# EAGLE design addressing-auto (EAGLE 7.7.0)
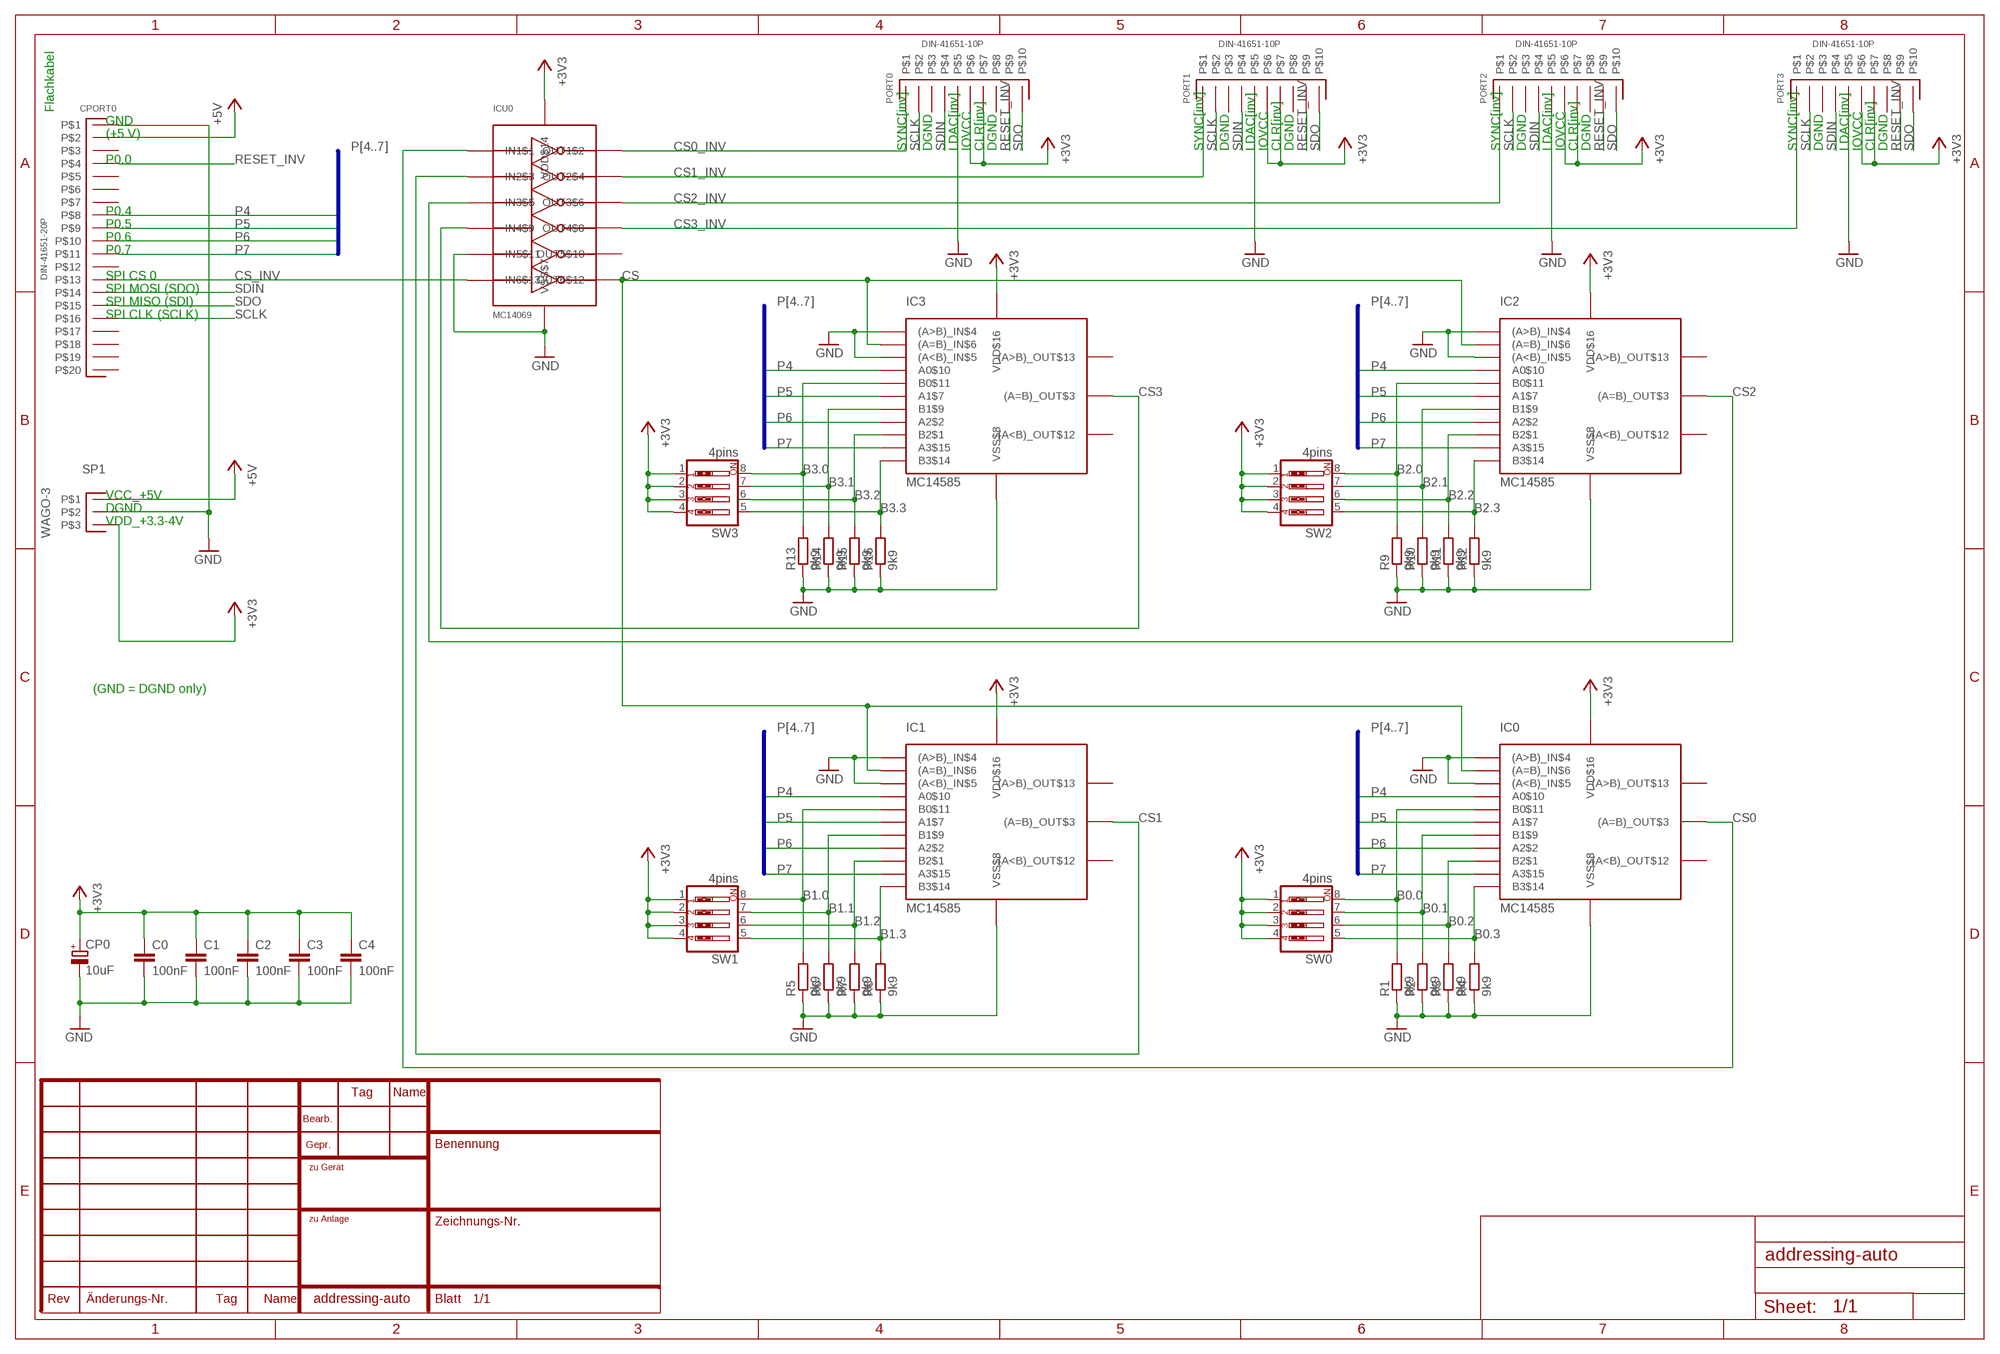
[diagram p0: schematic, sheet 1]

## Parts
C0  100nF  C-EU075-032X103  [C075-032X103]
C1  100nF  C-EU075-032X103  [C075-032X103]
C2  100nF  C-EU075-032X103  [C075-032X103]
C3  100nF  C-EU075-032X103  [C075-032X103]
C4  100nF  C-EU075-032X103  [C075-032X103]
CP0  10uF  CPOL-EUB45181B  [B45181B]
CPORT0  DIN-41651-20P  [DIN-41651-20P]
IC0  MC14585  [PDIP-16]
IC1  MC14585  [PDIP-16]
IC2  MC14585  [PDIP-16]
IC3  MC14585  [PDIP-16]
ICU0  MC14069  [PDIP-14]
PORT0  DIN-41651-10P  [DIN-41651-10P]
PORT1  DIN-41651-10P  [DIN-41651-10P]
PORT2  DIN-41651-10P  [DIN-41651-10P]
PORT3  DIN-41651-10P  [DIN-41651-10P]
R1  9k9  R-EU_0207/12  [0207/12]
R2  9k9  R-EU_0207/12  [0207/12]
R3  9k9  R-EU_0207/12  [0207/12]
R4  9k9  R-EU_0207/12  [0207/12]
R5  9k9  R-EU_0207/12  [0207/12]
R6  9k9  R-EU_0207/12  [0207/12]
R7  9k9  R-EU_0207/12  [0207/12]
R8  9k9  R-EU_0207/12  [0207/12]
R9  9k9  R-EU_0207/12  [0207/12]
R10  9k9  R-EU_0207/12  [0207/12]
R11  9k9  R-EU_0207/12  [0207/12]
R12  9k9  R-EU_0207/12  [0207/12]
R13  9k9  R-EU_0207/12  [0207/12]
R14  9k9  R-EU_0207/12  [0207/12]
R15  9k9  R-EU_0207/12  [0207/12]
R16  9k9  R-EU_0207/12  [0207/12]
SP1  WAGO-3  [WAGO-3]
SW0  4pins  SW_DIP-4  [EDG-04]
SW1  4pins  SW_DIP-4  [EDG-04]
SW2  4pins  SW_DIP-4  [EDG-04]
SW3  4pins  SW_DIP-4  [EDG-04]

## Nets
+3V3: C0.1 C1.1 C2.1 C3.1 C4.1 CP0.+ IC0.VDD$16 IC1.VDD$16 IC2.VDD$16 IC3.VDD$16 ICU0.VDD$14 PORT0.P$6 PORT0.P$7 PORT1.P$6 PORT1.P$7 PORT2.P$6 PORT2.P$7 PORT3.P$6 PORT3.P$7 SP1.P$3 SW0.1 SW0.2 SW0.3 SW0.4 SW1.1 SW1.2 SW1.3 SW1.4 SW2.1 SW2.2 SW2.3 SW2.4 SW3.1 SW3.2 SW3.3 SW3.4
+5V: CPORT0.P$2 SP1.P$1
B0.0: IC0.B0$11 R1.2 SW0.8
B0.1: IC0.B1$9 R2.2 SW0.7
B0.2: IC0.B2$1 R3.2 SW0.6
B0.3: IC0.B3$14 R4.2 SW0.5
B1.0: IC1.B0$11 R5.2 SW1.8
B1.1: IC1.B1$9 R6.2 SW1.7
B1.2: IC1.B2$1 R7.2 SW1.6
B1.3: IC1.B3$14 R8.2 SW1.5
B2.0: IC2.B0$11 R9.2 SW2.8
B2.1: IC2.B1$9 R10.2 SW2.7
B2.2: IC2.B2$1 R11.2 SW2.6
B2.3: IC2.B3$14 R12.2 SW2.5
B3.0: IC3.B0$11 R13.2 SW3.8
B3.1: IC3.B1$9 R14.2 SW3.7
B3.2: IC3.B2$1 R15.2 SW3.6
B3.3: IC3.B3$14 R16.2 SW3.5
CS: IC0.(A=B)_IN$6 IC1.(A=B)_IN$6 IC2.(A=B)_IN$6 IC3.(A=B)_IN$6 ICU0.OUT6$12
CS0: IC0.(A=B)_OUT$3 ICU0.IN1$1
CS0_INV: ICU0.OUT1$2 PORT0.P$1
CS1: IC1.(A=B)_OUT$3 ICU0.IN2$3
CS1_INV: ICU0.OUT2$4 PORT1.P$1
CS2: IC2.(A=B)_OUT$3 ICU0.IN3$5
CS2_INV: ICU0.OUT3$6 PORT2.P$1
CS3: IC3.(A=B)_OUT$3 ICU0.IN4$9
CS3_INV: ICU0.OUT4$8 PORT3.P$1
CS_INV: CPORT0.P$13 ICU0.IN6$13
GND: C0.2 C1.2 C2.2 C3.2 C4.2 CP0.- CPORT0.P$1 IC0.(A<B)_IN$5 IC0.(A>B)_IN$4 IC0.VSS$8 IC1.(A<B)_IN$5 IC1.(A>B)_IN$4 IC1.VSS$8 IC2.(A<B)_IN$5 IC2.(A>B)_IN$4 IC2.VSS$8 IC3.(A<B)_IN$5 IC3.(A>B)_IN$4 IC3.VSS$8 ICU0.IN5$11 ICU0.VSS$7 PORT0.P$5 PORT1.P$5 PORT2.P$5 PORT3.P$5 R1.1 R2.1 R3.1 R4.1 R5.1 R6.1 R7.1 R8.1 R9.1 R10.1 R11.1 R12.1 R13.1 R14.1 R15.1 R16.1 SP1.P$2
P4: CPORT0.P$8 IC0.A0$10 IC1.A0$10 IC2.A0$10 IC3.A0$10
P5: CPORT0.P$9 IC0.A1$7 IC1.A1$7 IC2.A1$7 IC3.A1$7
P6: CPORT0.P$10 IC0.A2$2 IC1.A2$2 IC2.A2$2 IC3.A2$2
P7: CPORT0.P$11 IC0.A3$15 IC1.A3$15 IC2.A3$15 IC3.A3$15
RESET_INV: CPORT0.P$4 PORT0.P$9 PORT1.P$9 PORT2.P$9 PORT3.P$9
SCLK: CPORT0.P$16 PORT0.P$2 PORT1.P$2 PORT2.P$2 PORT3.P$2
SDIN: CPORT0.P$14 PORT0.P$4 PORT1.P$4 PORT2.P$4 PORT3.P$4
SDO: CPORT0.P$15 PORT0.P$10 PORT1.P$10 PORT2.P$10 PORT3.P$10
Unconnected: CPORT0.P$3 CPORT0.P$5 CPORT0.P$6 CPORT0.P$7 CPORT0.P$12 CPORT0.P$17 CPORT0.P$18 CPORT0.P$19 CPORT0.P$20 IC0.(A<B)_OUT$12 IC0.(A>B)_OUT$13 IC1.(A<B)_OUT$12 IC1.(A>B)_OUT$13 IC2.(A<B)_OUT$12 IC2.(A>B)_OUT$13 IC3.(A<B)_OUT$12 IC3.(A>B)_OUT$13 ICU0.OUT5$10 PORT0.P$3 PORT0.P$8 PORT1.P$3 PORT1.P$8 PORT2.P$3 PORT2.P$8 PORT3.P$3 PORT3.P$8

## Buses
P[4..7]

## Notes on the sheet
- Flachkabel
- GND
- (+5 V)
- SYNC[inv] | DGND | LDAC[inv] | IOVCC | CLR[inv] | DGND | SYNC[inv] | DGND | LDAC[inv] | IOVCC | CLR[inv] | DGND | SYNC[inv] | DGND | LDAC[inv] | IOVCC | CLR[inv] | DGND | SYNC[inv] | DGND | LDAC[inv] | IOVCC | CLR[inv] | DGND
- P0.0
- P0.4
- P0.5
- P0.6
- P0.7
- SPI CS 0
- SPI MOSI (SDO)
- SPI MISO (SDI)
- SPI CLK (SCLK)
- VCC_+5V
- DGND
- VDD_+3.3-4V
- (GND = DGND only)

## Library data of the parts
C0 C1-C4 = rcl:C-EU: CAPACITOR, European symbol
CP0 = rcl:CPOL-EU: POLARIZED CAPACITOR, European symbol
CPORT0 = parts:DIN-41651-20P
IC0 IC1-IC3 = parts:MC14585
ICU0 = parts:MC14069
PORT0 PORT1-PORT3 = parts:DIN-41651-10P
R1-R16 = rcl:R-EU_: RESISTOR, European symbol
SP1 = parts:WAGO-3
SW0 SW1-SW3 = special:SW_DIP-4: DIP SWITCH

## Board
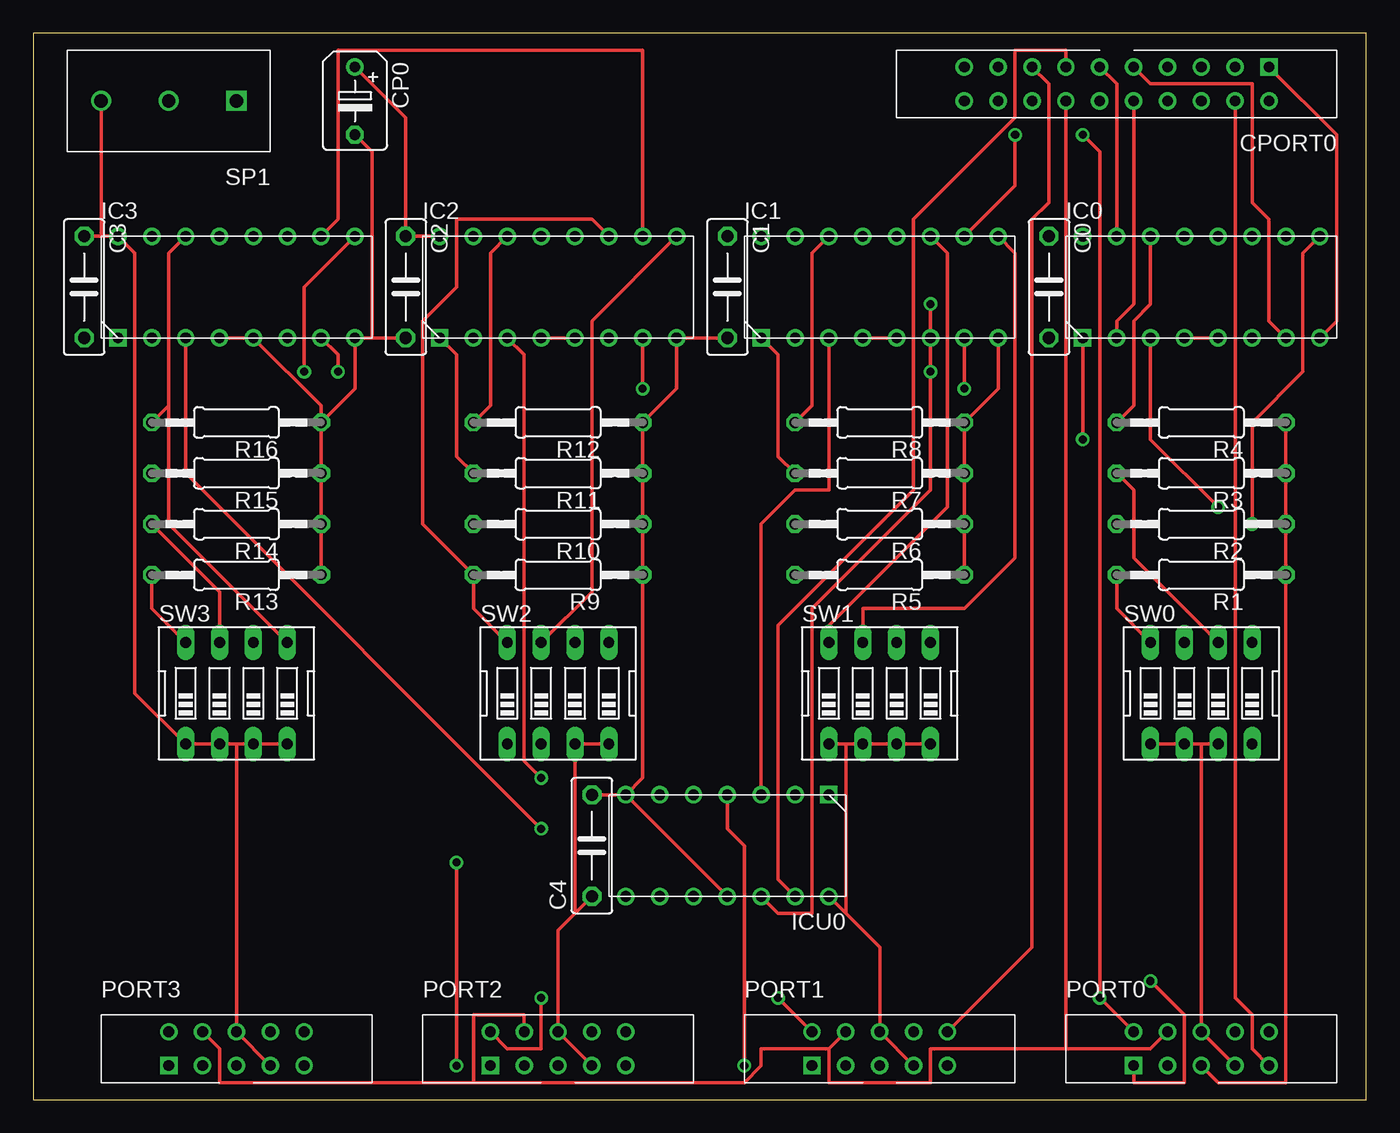
[diagram p1: board, top side]
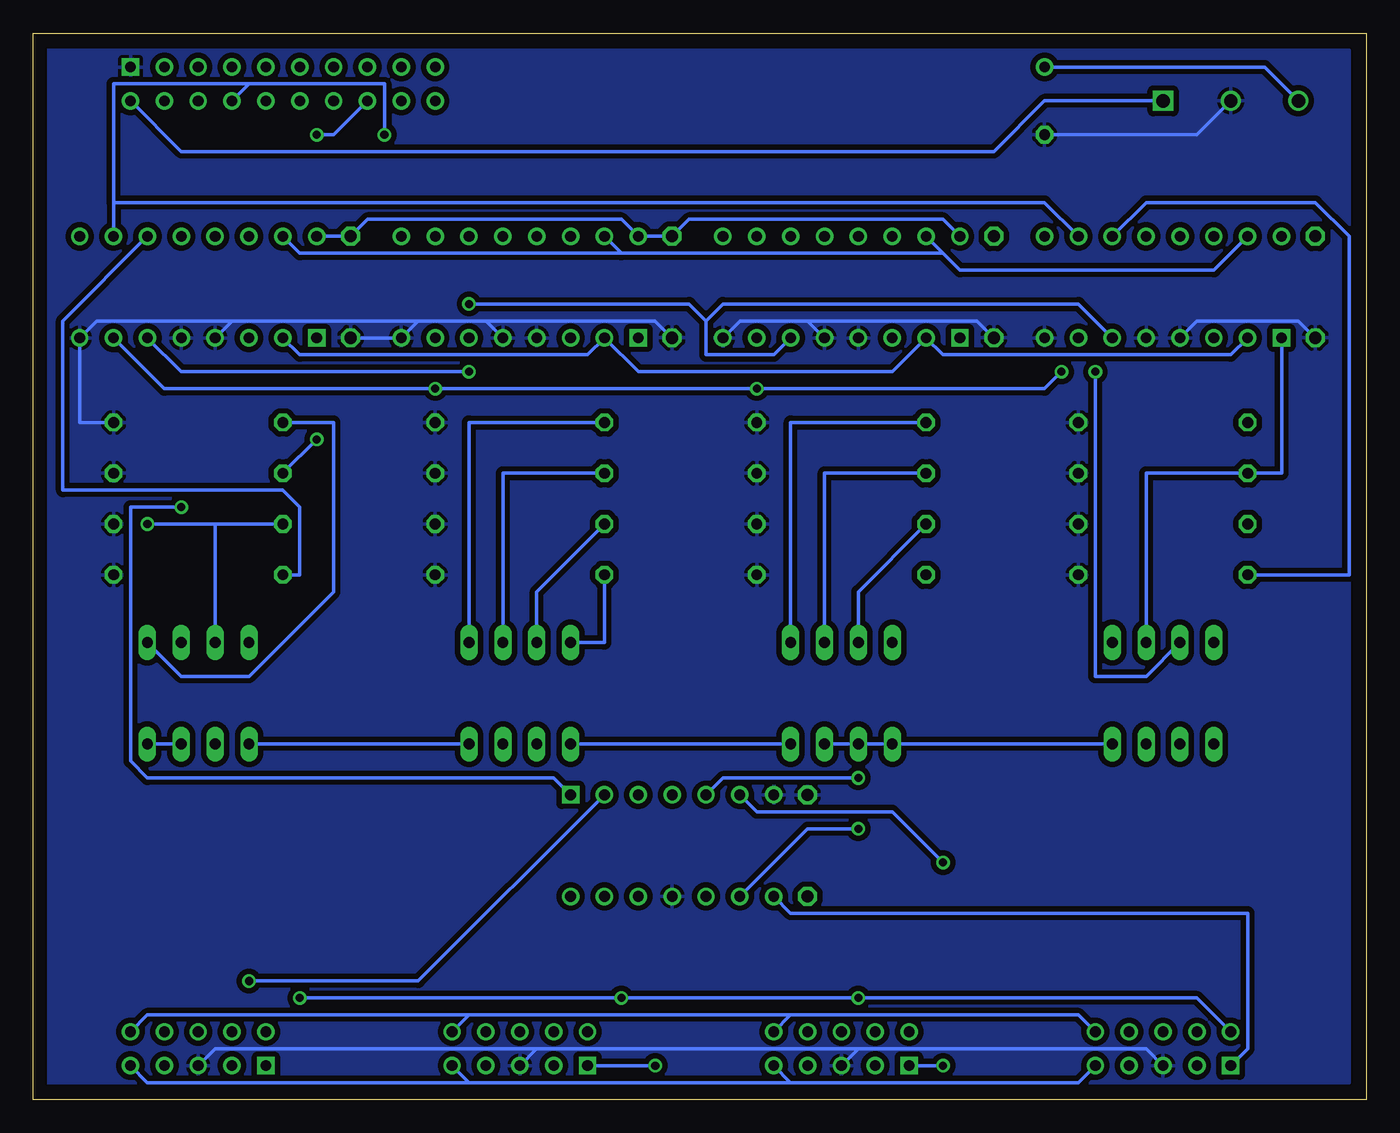
[diagram p2: board, bottom side, seen from below]

Size 100 x 80 mm. Coordinates in mm from the lower left corner, seen from the top.
Outline: 0,0 100,0 100,80 0,80 0,0
Copper layers (1*16): Top 0.035mm / dielectric 1.5mm / Bottom 0.035mm
Design rules "default": minimum track width 10mil, minimum drill 24mil, track to track 8mil, track to pad 8mil, pad to pad 8mil, via to via 8mil, smd to smd 8mil, copper to edge 40mil, drill to drill 8mil, minimum pad ring 10mil, minimum via ring 8mil, stop-mask expansion 4mil, vias tented up to drill 0mil, thermal gap 10mil

### Footprints (pad centres in the part's own frame; a part is rotated, then mirrored left to right if it is on the bottom)
C075-032X103 = drill 0.914 octagon: 1 -3.81,0; 2 3.81,0
B45181B = drill 0.813: + -2.54,0 | drill 0.813 octagon: - 2.54,0
DIN-41651-20P = drill 0.8 square: P$1 -11.43,-1.27 | drill 0.8: P$2 -11.43,1.27; P$3 -8.89,-1.27; P$4 -8.89,1.27; P$5 -6.35,-1.27; P$6 -6.35,1.27; P$7 -3.81,-1.27; P$8 -3.81,1.27; P$9 -1.27,-1.27; P$10 -1.27,1.27; P$11 1.27,-1.27; P$12 1.27,1.27; P$13 3.81,-1.27; P$14 3.81,1.27; P$15 6.35,-1.27; P$16 6.35,1.27; P$17 8.89,-1.27; P$18 8.89,1.27; P$19 11.43,-1.27; P$20 11.43,1.27
PDIP-16 = drill 0.8: (A<B)_IN$5 1.27,-3.81; (A<B)_OUT$12 1.27,3.81; (A=B)_IN$6 3.81,-3.81; (A=B)_OUT$3 -3.81,-3.81; (A>B)_IN$4 -1.27,-3.81; (A>B)_OUT$13 -1.27,3.81; A0$10 6.35,3.81; A1$7 6.35,-3.81; A2$2 -6.35,-3.81; A3$15 -6.35,3.81; B0$11 3.81,3.81; B1$9 8.89,3.81; B3$14 -3.81,3.81; VDD$16 -8.89,3.81; VSS$8 8.89,-3.81 | drill 0.8 square: B2$1 -8.89,-3.81
PDIP-14 = drill 0.8 square: IN1$1 -7.62,-3.81 | drill 0.8: IN2$3 -2.54,-3.81; IN3$5 2.54,-3.81; IN4$9 5.08,3.81; IN5$11 0,3.81; IN6$13 -5.08,3.81; OUT1$2 -5.08,-3.81; OUT2$4 0,-3.81; OUT3$6 5.08,-3.81; OUT4$8 7.62,3.81; OUT5$10 2.54,3.81; OUT6$12 -2.54,3.81; VDD$14 -7.62,3.81; VSS$7 7.62,-3.81
DIN-41651-10P = drill 0.8 square: P$1 -5.08,-1.27 | drill 0.8: P$2 -5.08,1.27; P$3 -2.54,-1.27; P$4 -2.54,1.27; P$5 0,-1.27; P$6 0,1.27; P$7 2.54,-1.27; P$8 2.54,1.27; P$9 5.08,-1.27; P$10 5.08,1.27
0207/12 = drill 0.813 octagon: 1 -6.35,0; 2 6.35,0
WAGO-3 = drill 1 square: P$1 -5.08,0 | drill 1: P$2 0,0; P$3 5.08,0
EDG-04 = drill 0.813 long: 1 -3.81,-3.81; 2 -1.27,-3.81; 3 1.27,-3.81; 4 3.81,-3.81; 5 3.81,3.81; 6 1.27,3.81; 7 -1.27,3.81; 8 -3.81,3.81

### Placement (x,y rotation side)
C0  76.2,60.96 270 top
C1  52.07,60.96 270 top
C2  27.94,60.96 270 top
C3  3.81,60.96 270 top
C4  41.91,19.05 90 top
CP0  24.13,74.93 270 top
CPORT0  81.28,76.2 180 top
IC0  87.63,60.96 0 top
IC1  63.5,60.96 0 top
IC2  39.37,60.96 0 top
IC3  15.24,60.96 0 top
ICU0  52.07,19.05 180 top
PORT0  87.63,3.81 0 top
PORT1  63.5,3.81 0 top
PORT2  39.37,3.81 0 top
PORT3  15.24,3.81 0 top
R1  87.63,39.37 180 top
R2  87.63,43.18 180 top
R3  87.63,46.99 180 top
R4  87.63,50.8 180 top
R5  63.5,39.37 180 top
R6  63.5,43.18 180 top
R7  63.5,46.99 180 top
R8  63.5,50.8 180 top
R9  39.37,39.37 180 top
R10  39.37,43.18 180 top
R11  39.37,46.99 180 top
R12  39.37,50.8 180 top
R13  15.24,39.37 180 top
R14  15.24,43.18 180 top
R15  15.24,46.99 180 top
R16  15.24,50.8 180 top
SP1  10.16,74.93 180 top
SW0  87.63,30.48 0 top
SW1  63.5,30.48 0 top
SW2  39.37,30.48 0 top
SW3  15.24,30.48 0 top

### Tracks (layer width: path | path; a pad name or v marks a point on that pad's centre or on a via)
+3V3
  Top 0.254: 5.08,64.77 C3.1 | 5.08,64.77 IC3.VDD$16 7.62,63.5 7.62,30.48 SW3.1 SW3.2 15.24,26.67 | 5.08,64.77 SP1.P$3 | IC2.VDD$16 C2.1 27.94,73.66 CP0.+ | PORT3.P$7 PORT3.P$6 15.24,26.67 | 15.24,26.67 SW3.3 SW3.4 | SW2.4 SW2.3 40.64,13.97 | PORT2.P$7 PORT2.P$6 39.37,12.7 40.64,13.97 | 40.64,13.97 C4.1 | 60.96,26.67 SW1.2 SW1.3 SW1.4 | SW1.1 60.96,26.67 | PORT1.P$7 PORT1.P$6 63.5,11.43 60.96,13.97 | 60.96,13.97 ICU0.VDD$14 | 60.96,26.67 60.96,13.97 | PORT0.P$7 PORT0.P$6 87.63,26.67 | SW0.1 SW0.2 87.63,26.67 | 87.63,26.67 SW0.3
  Bottom 0.254: IC0.VDD$16 C0.1 74.93,66.04 55.88,66.04 IC1.VDD$16 C1.1 50.8,66.04 31.75,66.04 IC2.VDD$16 | SP1.P$3 7.62,77.47 CP0.+ | SW2.3 SW2.2 SW2.1 SW3.4 | SW0.3 SW0.4 | SW1.4 SW0.1 | SW2.4 SW1.1
+5V
  Bottom 0.254: CPORT0.P$2 88.9,71.12 27.94,71.12 24.13,74.93 SP1.P$1
B0.0
  Top 0.254: SW0.8 81.28,36.83 R1.2
  Bottom 0.254: IC0.B0$11 97.79,58.42 97.79,45.72 81.28,45.72 80.01,44.45 80.01,39.37 R1.2
B0.1  (via drill 0.61)
  Top 0.254: IC0.B1$9 95.25,63.5 95.25,54.61 91.44,50.8 v91.44,43.18
  Bottom 0.254: 86.36,43.18 R2.2 | 86.36,43.18 v91.44,43.18 | SW0.7 86.36,43.18
B0.2  (via drill 0.61)
  Top 0.254: v78.74,49.53 IC0.B2$1 | SW0.6 82.55,40.64 82.55,45.72 R3.2
  Bottom 0.254: R3.2 v78.74,49.53
B0.3
  Top 0.254: IC0.B3$14 83.82,59.69 82.55,58.42 82.55,52.07 R4.2
  Bottom 0.254: SW0.5 88.9,31.75 83.82,31.75 77.47,38.1 77.47,50.8 R4.2
B1.0
  Top 0.254: IC1.B0$11 68.58,63.5 68.58,44.45 59.69,35.56 SW1.8
  Bottom 0.254: R5.2 57.15,34.29 SW1.8
B1.1
  Top 0.254: IC1.B1$9 73.66,63.5 73.66,40.64 69.85,36.83 62.23,36.83 SW1.7
  Bottom 0.254: R6.2 62.23,38.1 SW1.7
B1.2
  Top 0.254: IC1.B2$1 55.88,55.88 55.88,48.26 R7.2
  Bottom 0.254: SW1.6 64.77,46.99 R7.2
B1.3
  Top 0.254: IC1.B3$14 58.42,63.5 58.42,52.07 R8.2
  Bottom 0.254: SW1.5 67.31,50.8 R8.2
B2.0
  Top 0.254: IC2.B0$11 41.91,66.04 31.75,66.04 31.75,60.96 29.21,58.42 29.21,43.18 R9.2 33.02,36.83 SW2.8
B2.1
  Top 0.254: IC2.B1$9 41.91,58.42 41.91,38.1 SW2.7
  Bottom 0.254: R10.2 38.1,38.1 SW2.7
B2.2
  Top 0.254: IC2.B2$1 31.75,55.88 31.75,48.26 R11.2
  Bottom 0.254: SW2.6 40.64,46.99 R11.2
B2.3
  Top 0.254: IC2.B3$14 34.29,63.5 34.29,52.07 R12.2
  Bottom 0.254: SW2.5 43.18,50.8 R12.2
B3.0
  Top 0.254: SW3.8 8.89,36.83 R13.2
  Bottom 0.254: IC3.B0$11 16.51,67.31 3.81,67.31 1.27,64.77 1.27,39.37 R13.2
B3.1  (via drill 0.61)
  Top 0.254: IC3.B1$9 20.32,60.96 v20.32,54.61 | R14.2 13.97,38.1 SW3.7
  Bottom 0.254: v20.32,54.61 20.32,31.75 16.51,31.75 SW3.7
B3.2
  Bottom 0.254: IC3.B2$1 6.35,46.99 R15.2 16.51,46.99 SW3.6
B3.3
  Top 0.254: IC3.B3$14 10.16,63.5 10.16,52.07 | 10.16,52.07 R16.2 | SW3.5 10.16,43.18 10.16,52.07
CS  (via drill 0.61)
  Top 0.254: ICU0.OUT6$12 55.88,13.97 58.42,13.97 58.42,36.83 67.31,45.72 v67.31,54.61 IC1.(A=B)_IN$6 v67.31,59.69
  Bottom 0.254: IC3.(A=B)_IN$6 21.59,59.69 48.26,59.69 49.53,58.42 | 49.53,58.42 49.53,55.88 44.45,55.88 IC2.(A=B)_IN$6 | IC0.(A=B)_IN$6 88.9,54.61 v67.31,54.61 | 49.53,58.42 50.8,59.69 v67.31,59.69
CS0  (via drill 0.61)
  Top 0.254: v88.9,44.45 83.82,49.53 IC0.(A=B)_OUT$3
  Bottom 0.254: ICU0.IN1$1 60.96,24.13 91.44,24.13 92.71,25.4 92.71,44.45 v88.9,44.45
CS0_INV  (via drill 0.61)
  Top 0.254: v83.82,8.89 86.36,6.35 86.36,1.27 82.55,1.27 PORT0.P$1
  Bottom 0.254: ICU0.OUT1$2 71.12,8.89 v83.82,8.89
CS1
  Top 0.254: ICU0.IN2$3 54.61,43.18 57.15,45.72 59.69,45.72 IC1.(A=B)_OUT$3
CS1_INV  (via drill 0.61)
  Top 0.254: v53.34,2.54 53.34,19.05 52.07,20.32 ICU0.OUT2$4
  Bottom 0.254: v53.34,2.54 PORT1.P$1
CS2  (via drill 0.61)
  Top 0.254: v38.1,24.13 36.83,25.4 36.83,55.88 IC2.(A=B)_OUT$3
  Bottom 0.254: ICU0.IN3$5 48.26,24.13 v38.1,24.13
CS2_INV  (via drill 0.61)
  Top 0.254: v31.75,2.54 v31.75,17.78
  Bottom 0.254: v31.75,2.54 PORT2.P$1 | v31.75,17.78 35.56,21.59 45.72,21.59 ICU0.OUT3$6
CS3  (via drill 0.61)
  Top 0.254: v38.1,20.32 11.43,46.99 IC3.(A=B)_OUT$3
  Bottom 0.254: ICU0.IN4$9 41.91,20.32 v38.1,20.32
CS3_INV
  Bottom 0.254: PORT3.P$1 8.89,3.81 8.89,13.97 43.18,13.97 ICU0.OUT4$8
CS_INV
  Top 0.254: ICU0.IN6$13 55.88,16.51 55.88,35.56 66.04,45.72 66.04,66.04 73.66,73.66 73.66,78.74 77.47,78.74 CPORT0.P$13
GND
  Top 0.254: IC3.(A>B)_IN$4 IC3.(A<B)_IN$5 21.59,52.07 R16.1 | R13.1 R14.1 R15.1 R16.1 | C2.2 25.4,57.15 | 25.4,57.15 IC3.VSS$8 24.13,53.34 R16.1 | CP0.- 25.4,71.12 25.4,57.15 | ICU0.VSS$7 C4.2 | ICU0.VSS$7 ICU0.IN5$11 | IC2.(A<B)_IN$5 IC2.(A>B)_IN$4 | C1.2 IC2.VSS$8 48.26,53.34 R12.1 R11.1 R10.1 R9.1 45.72,24.13 ICU0.VSS$7 | CPORT0.P$1 97.79,72.39 97.79,58.42 IC0.VSS$8 | R4.1 R3.1 R2.1 R1.1 93.98,1.27 88.9,1.27 PORT0.P$5 | R5.1 R6.1 R7.1 R8.1 72.39,53.34 IC1.VSS$8 | IC0.(A>B)_IN$4 IC0.(A<B)_IN$5 | IC1.(A<B)_IN$5 IC1.(A>B)_IN$4
  Bottom 0.254: PORT3.P$5 16.51,3.81 38.1,3.81 | 38.1,3.81 PORT2.P$5 | 62.23,3.81 PORT1.P$5 | 38.1,3.81 62.23,3.81 | PORT0.P$5 86.36,3.81 62.23,3.81 | C3.2 5.08,58.42 12.7,58.42 IC3.(A>B)_IN$4 | SP1.P$2 12.7,72.39 CP0.- | 41.91,58.42 IC2.(A<B)_IN$5 | 41.91,58.42 46.99,58.42 IC2.VSS$8 | R4.1 96.52,50.8 IC0.VSS$8 95.25,58.42 85.09,58.42 | C0.2 IC1.VSS$8 71.12,58.42 | 66.04,58.42 IC1.(A<B)_IN$5 | 71.12,58.42 66.04,58.42 | 85.09,58.42 IC0.(A>B)_IN$4 | 85.09,58.42 71.12,58.42 | C1.2 53.34,58.42 66.04,58.42 | C2.2 29.21,58.42 41.91,58.42
  pour Bottom (isolate 0.406): 1.27,78.74 99.06,78.74 99.06,1.27 1.27,1.27
P4  (via drill 0.61)
  Top 0.254: IC1.A0$10 73.66,68.58 v73.66,72.39 | IC3.A0$10 22.86,66.04 22.86,78.74 45.72,78.74 IC2.A0$10
  Bottom 0.254: v73.66,72.39 73.66,76.2 83.82,76.2 | 83.82,76.2 CPORT0.P$8 | 93.98,67.31 93.98,76.2 83.82,76.2 | 93.98,67.31 IC0.A0$10 | 93.98,67.31 24.13,67.31 IC3.A0$10
P5  (via drill 0.61)
  Top 0.254: IC3.A1$7 22.86,55.88 v22.86,54.61 | v45.72,53.34 IC2.A1$7 | v69.85,53.34 IC1.A1$7 | CPORT0.P$9 83.82,76.2 91.44,76.2 91.44,67.31 92.71,66.04 92.71,58.42 IC0.A1$7
  Bottom 0.254: v22.86,54.61 24.13,53.34 v45.72,53.34 v69.85,53.34 90.17,53.34 IC0.A1$7
P6
  Top 0.254: CPORT0.P$10 82.55,59.69 81.28,58.42 IC0.A2$2
  Bottom 0.254: IC3.A2$2 10.16,55.88 31.75,55.88 IC2.A2$2 35.56,54.61 54.61,54.61 IC1.A2$2 58.42,55.88 80.01,55.88 IC0.A2$2
P7
  Top 0.254: CPORT0.P$11 81.28,76.2 IC0.A3$15
  Bottom 0.254: IC3.A3$15 11.43,62.23 30.48,62.23 31.75,63.5 | 31.75,63.5 IC2.A3$15 | 55.88,63.5 IC1.A3$15 | 31.75,63.5 55.88,63.5 | IC0.A3$15 80.01,63.5 55.88,63.5
RESET_INV
  Top 0.254: CPORT0.P$4 90.17,7.62 91.44,6.35 91.44,3.81 PORT0.P$9
  Bottom 0.254: PORT3.P$9 21.59,1.27 43.18,1.27 | 43.18,1.27 PORT2.P$9 | 67.31,1.27 PORT1.P$9 | 43.18,1.27 67.31,1.27 | PORT0.P$9 91.44,1.27 67.31,1.27
SCLK  (via drill 0.61)
  Top 0.254: v55.88,7.62 PORT1.P$2 | PORT2.P$2 35.56,3.81 38.1,3.81 v38.1,7.62 | v78.74,72.39 80.01,71.12 v80.01,7.62 PORT0.P$2
  Bottom 0.254: PORT3.P$2 12.7,7.62 v38.1,7.62 v55.88,7.62 v80.01,7.62 | CPORT0.P$16 77.47,72.39 v78.74,72.39
SDIN
  Top 0.254: PORT3.P$4 13.97,3.81 13.97,1.27 33.02,1.27 | 33.02,1.27 33.02,6.35 36.83,6.35 PORT2.P$4 | 59.69,3.81 PORT1.P$4 | 59.69,3.81 54.61,3.81 54.61,2.54 53.34,1.27 33.02,1.27 | PORT0.P$4 83.82,3.81 77.47,3.81 | 77.47,3.81 67.31,3.81 67.31,1.27 59.69,1.27 59.69,3.81 | 77.47,3.81 CPORT0.P$14
SDO
  Top 0.254: CPORT0.P$15 76.2,76.2 76.2,67.31 74.93,66.04 74.93,11.43 PORT1.P$10
  Bottom 0.254: PORT3.P$10 21.59,6.35 43.18,6.35 | 43.18,6.35 PORT2.P$10 | 67.31,6.35 PORT1.P$10 | 43.18,6.35 67.31,6.35 | PORT0.P$10 91.44,6.35 67.31,6.35